# EAGLE schematic Motor (EAGLE 9.6.2)
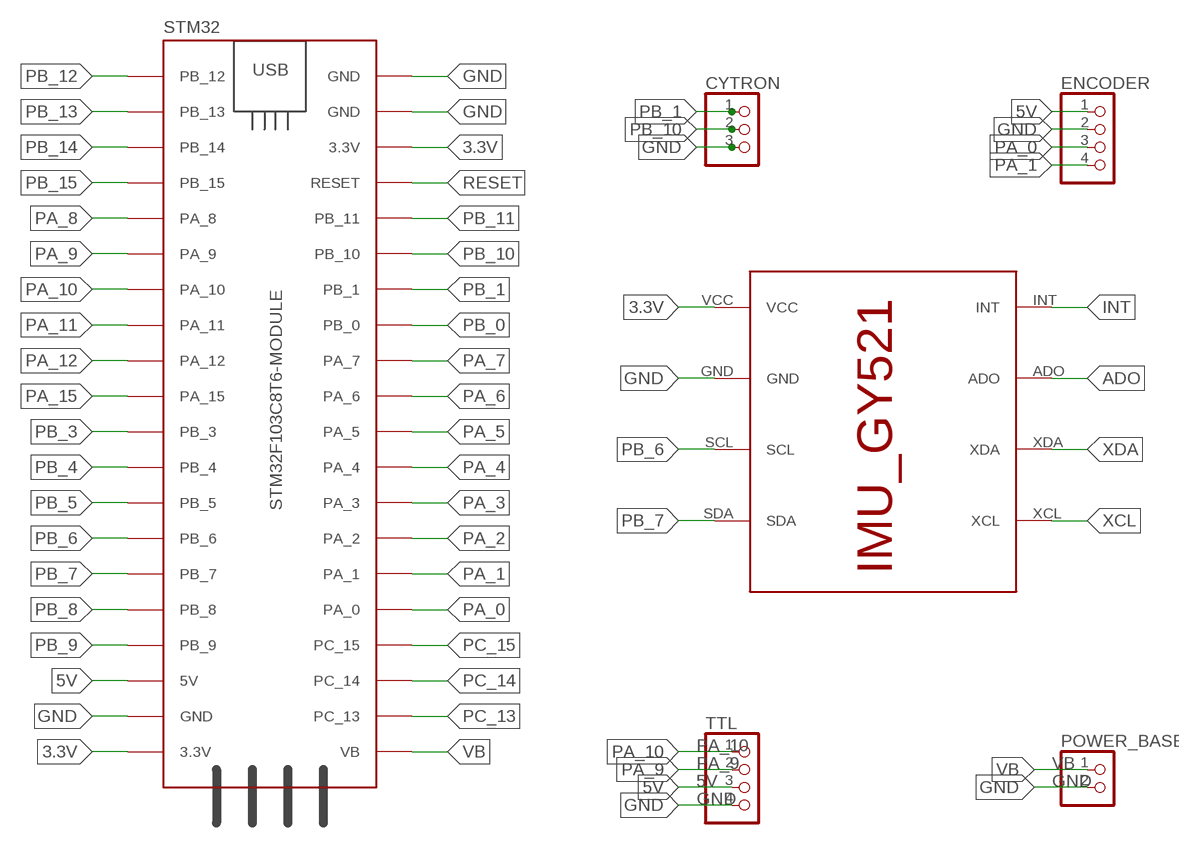
[diagram p0: schematic, sheet 1]

## Parts
CYTRON  PINHD-3_DATA  [1X03_DATA]
ENCODER  PINHD-4_DATA  [1X04_DATA]
IMU  IMU_ROBOCON_GY521  [IMU_GY521]
POWER_BASE  PINHD-2_DATA  [1X02_DATA]
STM32  STM32F103C8T6-MODULE  [STM32F103C8T6-MODULE]
TTL  PINHD-4_DATA  [1X04_DATA]

## Nets
3.3V: IMU.VCC STM32.3.3V_1(3.3V) STM32.3.3V_2(3.3V)
5V: ENCODER.1 STM32.5V TTL.3
ADO: IMU.ADO
GND: CYTRON.3 ENCODER.2 IMU.GND POWER_BASE.2 STM32.GND_1(GND) STM32.GND_2(GND) STM32.GND_3(GND) TTL.4
INT: IMU.INT
PA_0: ENCODER.3 STM32.PA_0
PA_1: ENCODER.4 STM32.PA_1
PA_2: STM32.PA_2
PA_3: STM32.PA_3
PA_4: STM32.PA_4
PA_5: STM32.PA_5
PA_6: STM32.PA_6
PA_7: STM32.PA_7
PA_8: STM32.PA_8
PA_9: STM32.PA_9 TTL.2
PA_10: STM32.PA_10 TTL.1
PA_11: STM32.PA_11
PA_12: STM32.PA_12
PA_15: STM32.PA_15
PB_0: STM32.PB_0
PB_1: CYTRON.1 STM32.PB_1
PB_3: STM32.PB_3
PB_4: STM32.PB_4
PB_5: STM32.PB_5
PB_6: IMU.SCL STM32.PB_6
PB_7: IMU.SDA STM32.PB_7
PB_8: STM32.PB_8
PB_9: STM32.PB_9
PB_10: CYTRON.2 STM32.PB_10
PB_11: STM32.PB_11
PB_12: STM32.PB_12
PB_13: STM32.PB_13
PB_14: STM32.PB_14
PB_15: STM32.PB_15
PC_13: STM32.PC_13
PC_14: STM32.PC_14
PC_15: STM32.PC_15
RESET: STM32.RESET
VB: POWER_BASE.1 STM32.VB
XCL: IMU.XCL
XDA: IMU.XDA

## Library data of the parts
CYTRON = MIA_LIBRARY-2-2-2:PINHD-3_DATA: PIN HEADER
ENCODER TTL = MIA_LIBRARY-2-2-2:PINHD-4_DATA: PIN HEADER
IMU = MIA_LIBRARY-2-2-2:IMU_ROBOCON_GY521
POWER_BASE = MIA_LIBRARY-2-2-2:PINHD-2_DATA: PIN HEADER
STM32 = MIA_LIBRARY-2-2-2:STM32F103C8T6-MODULE: STM32F103C8T6 module with ARM Cortex-3, 20kB SRAM, 64kB Flash, 72MHz